# EAGLE schematic AstableMultivibrator-PNP-CapPol (EAGLE 7.2.0)
Forced quenching improves three-transistor FM tuner Lyle Williams -February 29, 2016 http://edn.com/design/diy/4441531/Forced-quenching-improves-three-transistor-FM-tuner
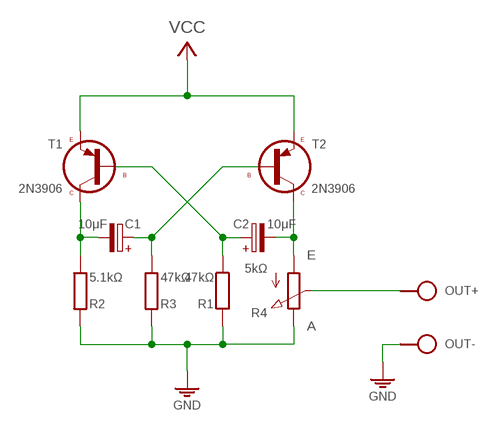
[diagram p0: schematic, sheet 1]

## Parts
C1  10μF  CPOL-HE2,5-4  [E2,5-4]
C2  10μF  CPOL-HE2,5-4  [E2,5-4]
J1  VCC_GNDPWR-L  [PWR-L]
OUT  SPAD+--+  [SPAD-+]
R1  47kΩ  R0204/10-V  [0204/10-V]
R2  5.1kΩ  R0204/10-V  [0204/10-V]
R3  47kΩ  R0204/10-V  [0204/10-V]
R4  5kΩ  POT-TRIM  [TRIM-POT]
T1  2N3906  [TO92]
T2  2N3906  [TO92]

## Nets
GND: J1.1 OUT.1 R1.1 R2.1 R3.1 R4.E
N$1: C2.- R4.A T2.3(C)
N$2: C1.- R2.2 T1.3(C)
N$3: C2.+ R1.2 T1.2(B)
N$4: C1.+ R3.2 T2.2(B)
N$6: OUT.2 R4.S
VCC: J1.2 T1.1(E) T2.1(E)

## Library data of the parts
C1 C2 = c:CPOL-H
J1 = pad:VCC_GND
OUT = pad:SPAD+-
R1-R3 = r:R: RESISTOR, European symbol
R4 = r:POT
T1 T2 = t:2N3906

## Net classes
0 default: width 0.61 mm